# EAGLE design RS232 (EAGLE 4.15)
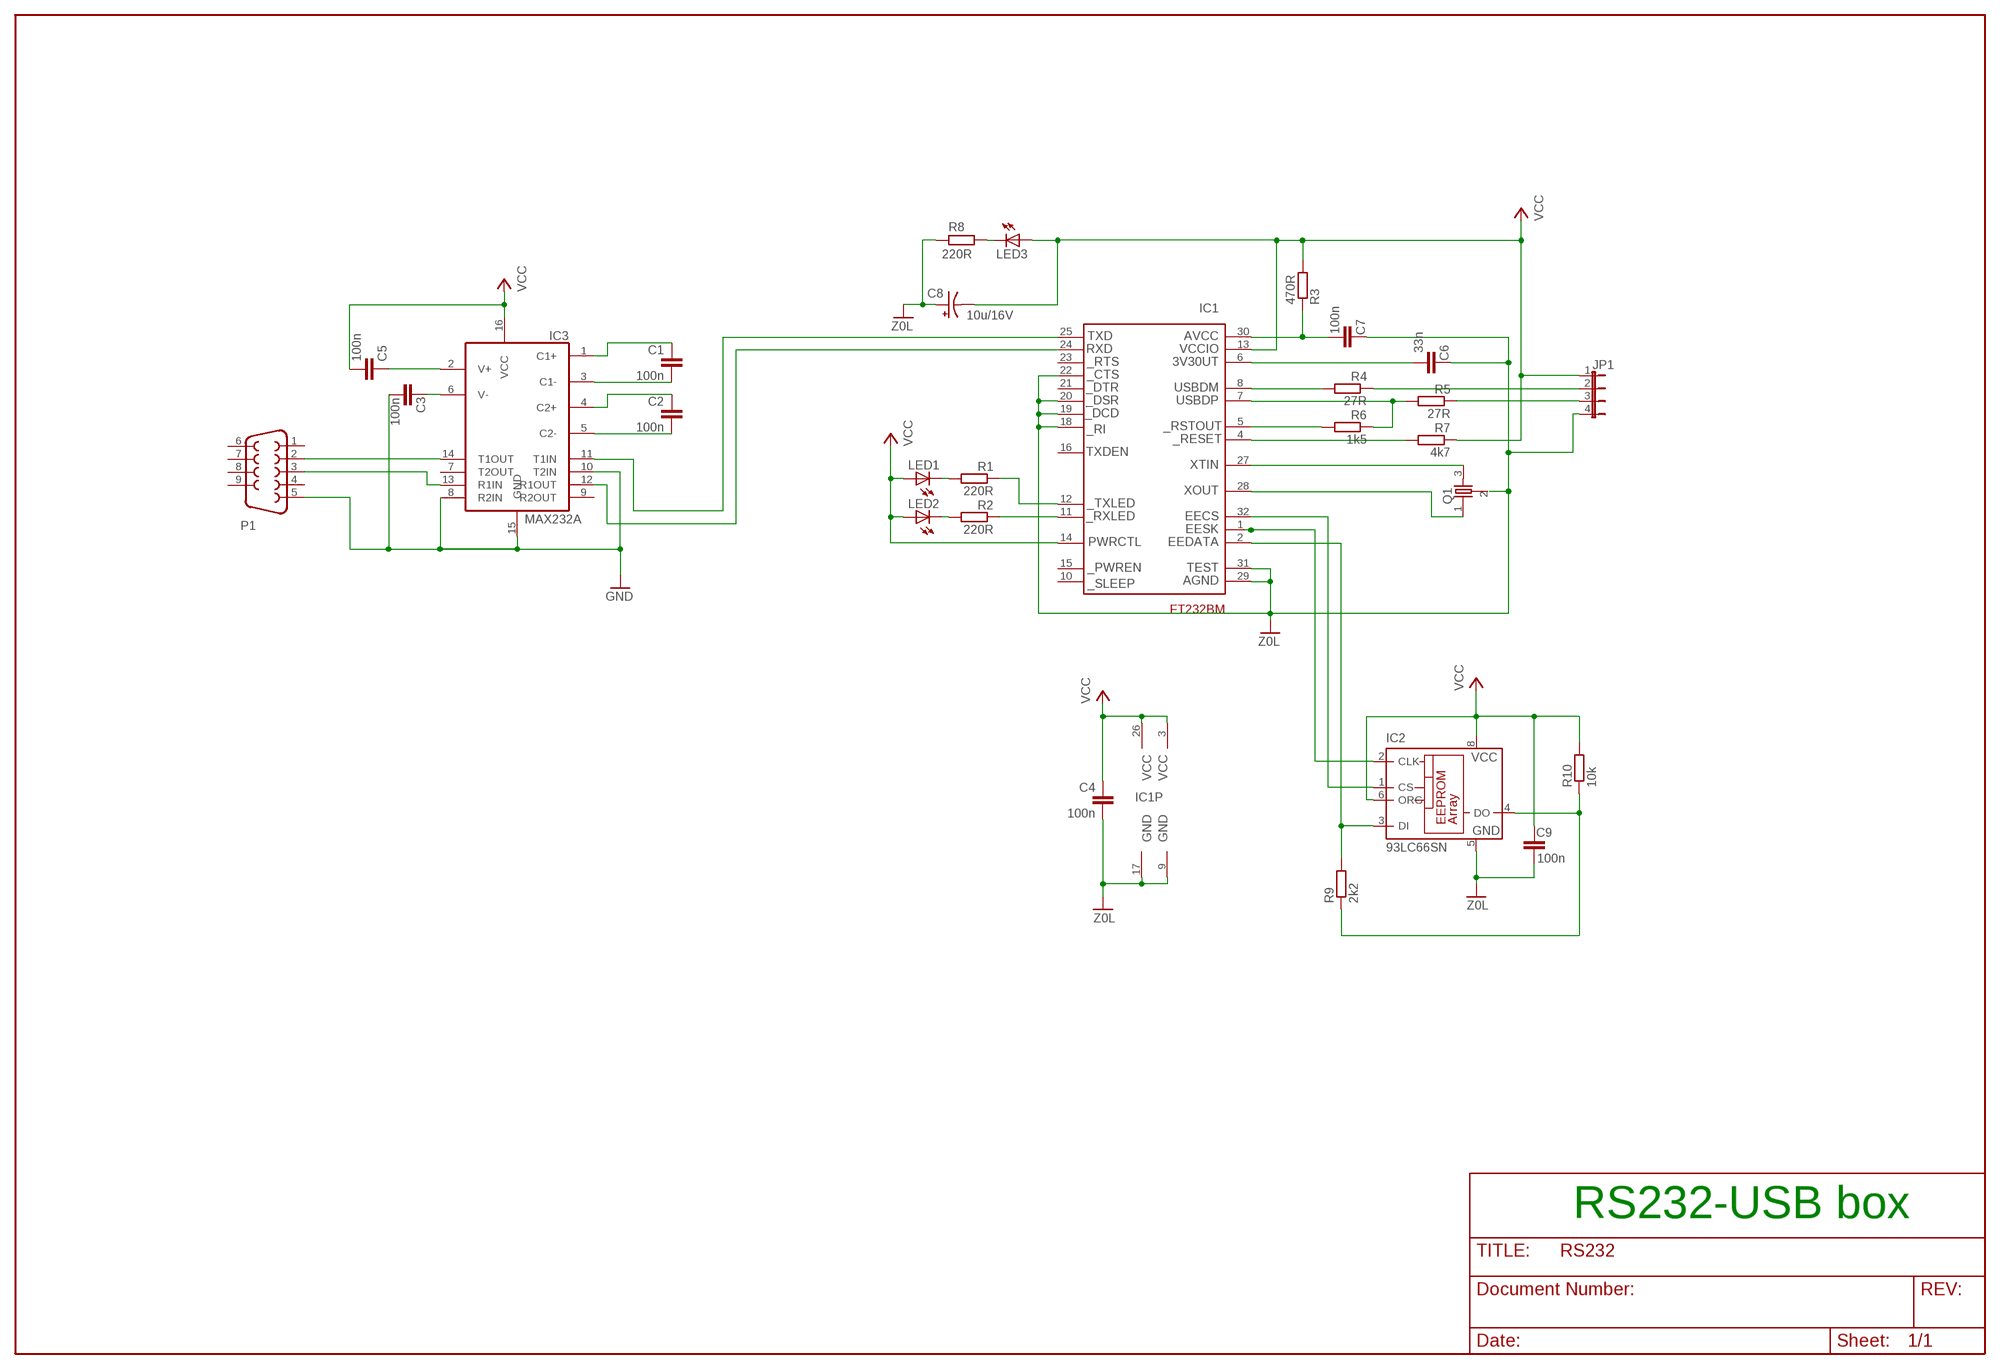
[diagram p0: schematic, sheet 1]

## Parts
C1  100n  C-EUC0805K  [C0805K]
C2  100n  C-EUC0805K  [C0805K]
C3  100n  C-EUC0805K  [C0805K]
C4  100n  C-EUC0805K  [C0805K]
C5  100n  C-EUC0805K  [C0805K]
C6  33n  C-EUC0805K  [C0805K]
C7  100n  C-EUC0805K  [C0805K]
C8  10u/16V  CPOL-USB  [PANASONIC_B]
C9  100n  C-EUC0805K  [C0805K]
IC1  FT232BM  [TQFP32-08]
IC2  93LC66SN  [SO-08]
IC3  MAX232A  [SO16]
JP1  JP4E  [JP4]
LED1  LED3MM  [LED3MM]
LED2  LED3MM  [LED3MM]
LED3  LED3MM  [LED3MM]
P1  D_SUB_CONNECTOR_SMD  [D_SUB_DON_SMD]
Q1  MURATA_RESONATOR  [MURATA_RESONATOR]
R1  220R  R-EU_M0805  [M0805]
R2  220R  R-EU_M0805  [M0805]
R3  470R  R-EU_M0805  [M0805]
R4  27R  R-EU_M0805  [M0805]
R5  27R  R-EU_M0805  [M0805]
R6  1k5  R-EU_M0805  [M0805]
R7  4k7  R-EU_M0805  [M0805]
R8  220R  R-EU_M0805  [M0805]
R9  2k2  R-EU_M0805  [M0805]
R10  10k  R-EU_M0805  [M0805]

## Nets
0V: C4.2 C6.1 C7.1 C8.+ C9.2 IC1.9 IC1.17 IC1.18 IC1.19 IC1.20 IC1.22 IC1.29 IC1.31 IC2.5(GND) JP1.4 Q1.2 R8.1 ; supply symbol labelled Z0L
GND: C3.2 IC3.8(R2IN) IC3.10(T2IN) IC3.15(GND) P1.5
N$1: IC1.12 R1.1
N$2: IC3.13(R1IN) P1.3
N$3: IC1.11 R2.1
N$4: IC1.1 IC2.2(CLK)
N$5: LED1.K(C) R1.2
N$6: LED2.K(C) R2.2
N$7: C6.2 IC1.6
N$8: C7.2 IC1.30 R3.1
N$9: IC1.8 R4.2
N$10: JP1.2 R4.1
N$11: IC1.7 R5.2 R6.1
N$12: JP1.3 R5.1
N$13: IC1.5 R6.2
N$14: IC1.4 R7.2
N$15: LED3.K(C) R8.2
N$16: IC1.32 IC2.1(CS)
N$17: C8.- LED3.A
N$18: IC1.27 Q1.3
N$19: IC1.28 Q1.1
N$21: IC1.2 IC2.3(DI) R9.2
N$22: IC1.24 IC3.12(R1OUT)
N$23: IC1.25 IC3.11(T1IN)
N$24: IC3.14(T1OUT) P1.2
N$25: IC2.4(DO) R9.1 R10.1
N$36: C2.2 IC3.5(C2-)
N$37: C2.1 IC3.4(C2+)
N$38: C1.2 IC3.3(C1-)
N$39: C1.1 IC3.1(C1+)
N$40: C5.1 IC3.2(V+)
N$41: C3.1 IC3.6(V-)
VCC: C4.1 C5.2 C9.1 IC1.3 IC1.13 IC1.14 IC1.26 IC2.6(ORG) IC2.8(VCC) IC3.16(VCC) JP1.1 LED1.A LED2.A R3.2 R7.1 R10.2
Unconnected: IC1.10 IC1.15 IC1.16 IC1.21 IC1.23 IC2.7(NU) IC3.7(T2OUT) IC3.9(R2OUT) P1.1 P1.4 P1.6 P1.7 P1.8 P1.9

## Notes on the sheet
- RS232-USB box

## Library data of the parts
C1-C7 C9 = rcl:C-EU: CAPACITOR, European symbol
C8 = rcl:CPOL-US: POLARIZED CAPACITOR, American symbol
IC1 = lbm:FT232BM: MICROCONTROLLER 2 Kbytes FLASH 128 bytes SRAM 128 bytes EEPROM UART 6-channel 10-bit ADC
IC2 = microchip:93*: Serial EPROM 1 K/2 K/4 K, low voltage, Microwire
IC3 = lbm:MAX232A
JP1 = jumper:JP4E: JUMPER
LED1-LED3 = led:LED: LED OSRAM: - CHIPLED LG R971, LG N971, LY N971, LG Q971, LY Q971, LO R971, LY R971 LH N974, LH R974 LS Q976, LO Q976, LY Q976 LO Q996 - Hyper CHIPLED LW Q18S LB Q993, LB Q99A, LB R99A - SideLED LS A670, LO A670, LY A670, LG A670, LP A670 LB A673, LV A673, LT A673, LW A673 LH A674 LY A675 LS A676, LA A676, LO A676, LY A676, LW A676 LS A679, LY A679, LG A679 - Hyper Micro SIDELED® LS Y876, LA Y876, LO Y876, LY Y876 LT Y87S - SmartLED LW L88C, LW L88S LB L89C, LB L89S, LG L890 LS L89K, LO L89K, LY L89K LS L896, LA L896, LO L896, LY L896 - TOPLED LS T670, LO T670, LY T670, LG T670, LP T670 LSG T670, LSP T670, LSY T670, LOP T670, LYG T670 LG T671, LOG T671, LSG T671 LB T673, LV T673, LT T673, LW T673 LH T674 LS T676, LA T676, LO T676, LY T676, LB T676, LH T676, LSB T676, LW T676 LB T67C, LV T67C, LT T67C, LS T67K, LO T67K, LY T67K, LW E67C LS E67B, LA E67B, LO E67B, LY E67B, LB E67C, LV E67C, LT E67C LW T67C LS T679, LY T679, LG T679 LS T770, LO T770, LY T770, LG T770, LP T770 LB T773, LV T773, LT T773, LW T773 LH T774 LS E675, LA E675, LY E675, LS T675 LS T776, LA T776, LO T776, LY T776, LB T776 LHGB T686 LT T68C, LB T68C - Hyper Mini TOPLED® LB M676 - Mini TOPLED Santana® LG M470 LS M47K, LO M47K, LY M47K Source: http://www.osram.convergy.de/
P1 = lbm:D_SUB_CONNECTOR_SMD
Q1 = lbm:MURATA_RESONATOR
R1-R10 = rcl:R-EU_: RESISTOR, European symbol

## Board
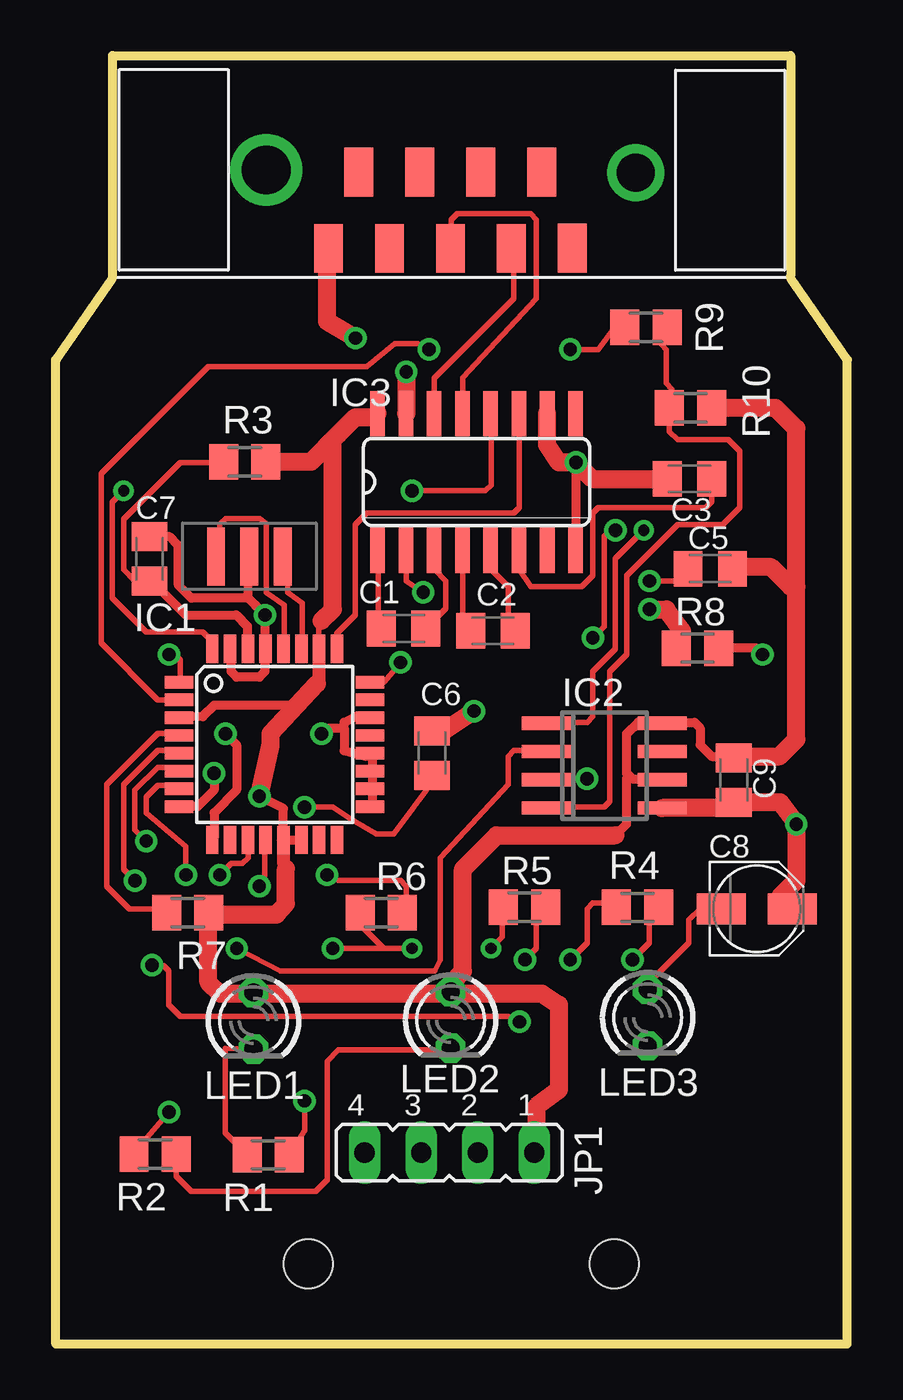
[diagram p1: board, top side]
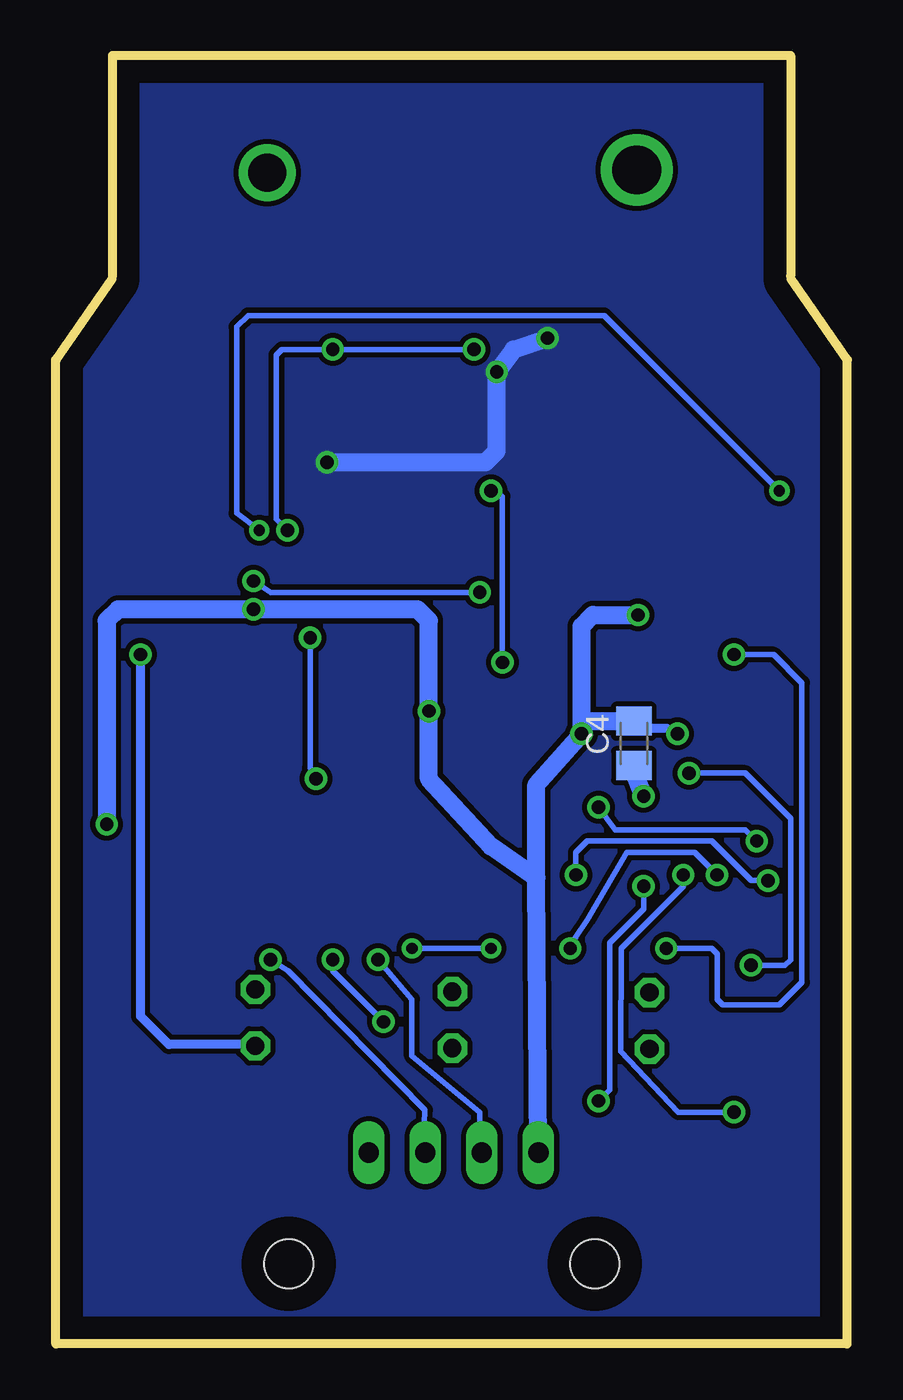
[diagram p2: board, bottom side, seen from below]

Size 35.58 x 57.91 mm. Coordinates in mm from the lower left corner, seen from the top.
Outline: 35.57,44.2 35.57,0 0.01,0 0.01,44.2
Outline: 2.54,47.88 0,44.22
Outline: 33.03,48.01 33.03,57.91 2.55,57.91 2.55,48.01
Outline: 33.04,47.88 35.58,44.22
Copper layers (1*16): Top 0.035mm / dielectric 1.5mm / Bottom 0.035mm
Design rules "default": minimum track width 8mil, minimum drill 20mil, track to track 9mil, track to pad 8mil, pad to pad 7mil, via to via 8mil, smd to smd 8mil, copper to edge 40mil, drill to drill 8mil, minimum pad ring 10mil, minimum via ring 8mil, stop-mask expansion 4mil, vias tented up to drill 0mil, thermal gap 10mil
Holes 2.2 mm at 11.36,3.6 25.1,3.6

### Footprints (pad centres in the part's own frame; a part is rotated, then mirrored left to right if it is on the bottom)
C0805K = smd 1.3 x 1.6: 1 -1,0; 2 1,0
PANASONIC_B = smd 2.2 x 1.4: + 1.6,0; - -1.6,0
TQFP32-08 = smd 1.27 x 0.559: 1 -4.293,2.8; 2 -4.293,2; 3 -4.293,1.2; 4 -4.293,0.4; 5 -4.293,-0.4; 6 -4.293,-1.2; 7 -4.293,-2; 8 -4.293,-2.8; 17 4.293,-2.8; 18 4.293,-2; 19 4.293,-1.2; 20 4.293,-0.4; 21 4.293,0.4; 22 4.293,1.2; 23 4.293,2; 24 4.293,2.8 | smd 0.559 x 1.27: 9 -2.8,-4.293; 10 -2,-4.293; 11 -1.2,-4.293; 12 -0.4,-4.293; 13 0.4,-4.293; 14 1.2,-4.293; 15 2,-4.293; 16 2.8,-4.293; 25 2.8,4.293; 26 2,4.293; 27 1.2,4.293; 28 0.4,4.293; 29 -0.4,4.293; 30 -1.2,4.293; 31 -2,4.293; 32 -2.8,4.293
SO-08 = smd 0.6 x 2.2: 1 -1.905,-2.6; 2 -0.635,-2.6; 3 0.635,-2.6; 4 1.905,-2.6; 5 1.905,2.6; 6 0.635,2.6; 7 -0.635,2.6; 8 -1.905,2.6
SO16 = smd 0.66 x 2.032: 1 -4.445,-3.073; 2 -3.175,-3.073; 3 -1.905,-3.073; 4 -0.635,-3.073; 5 0.635,-3.073; 6 1.905,-3.073; 7 3.175,-3.073; 8 4.445,-3.073; 9 4.445,3.073; 10 3.175,3.073; 11 1.905,3.073; 12 0.635,3.073; 13 -0.635,3.073; 14 -1.905,3.073; 15 -3.175,3.073; 16 -4.445,3.073
JP4 = drill 0.914 long: 1 -3.81,0; 2 -1.27,0; 3 1.27,0; 4 3.81,0
LED3MM = drill 0.813 octagon: A -1.27,0; K 1.27,0
D_SUB_DON_SMD = smd 1.3 x 2.2: 1 10.26,-2.308; 2 7.52,-2.318; 3 4.78,-2.318; 4 2.04,-2.318; 5 -0.7,-2.318; 6 8.88,1.102; 7 6.14,1.102; 8 3.4,1.102; 9 0.66,1.102 | drill 2.2 round: P$1 -3.5,1.21 | drill 1.7 round: P$2 13.11,1.09
MURATA_RESONATOR = smd 0.8 x 2.6: 1 -1.5,0; 2 0,0; 3 1.5,0
M0805 = smd 1.3 x 1.6: 1 -0.95,0; 2 0.95,0

### Placement (x,y rotation side)
C1  15.64,32.16 0 top
C2  19.65,32.06 0 top
C3  28.49,38.89 180 top
C4  9.59,26.99 90 bottom
C5  29.42,34.85 0 top
C6  16.92,26.56 270 top
C7  4.21,35.29 270 top
C8  31.51,19.56 0 top
C9  30.47,25.35 270 top
IC1  9.84,26.95 0 top
IC2  24.66,25.99 270 top
IC3  18.91,38.75 0 top
JP1  17.7,8.59 180 top
LED1  8.89,14.53 270 top
LED2  17.75,14.57 270 top
LED3  26.61,14.67 270 top
P1  12.96,51.56 0 top
Q1  8.71,35.4 0 top
R1  9.55,8.5 180 top
R2  4.47,8.53 0 top
R3  8.5,39.65 0 top
R4  26.15,19.62 180 top
R5  21.07,19.64 180 top
R6  14.63,19.38 0 top
R7  5.94,19.38 180 top
R8  28.84,31.28 0 top
R9  26.53,45.7 180 top
R10  28.53,42.07 0 top

### Tracks (layer width: path | path; a pad name or v marks a point on that pad's centre or on a via)
0V  (via drill 0.6)
  Top 0.406: 14.09,28.19 IC1.22 13.92,28.19 13.47,28.19 12.96,27.94 12.96,27.69 | IC1.17 14.23,24.25 14.23,24.89 | 14.23,26.42 14.23,24.89 | 14.23,26.42 14.23,26.45 IC1.20 14.11,26.55 13.98,26.42 12.96,26.67 12.96,27.69 | IC1.19 14.23,25.85 14.23,26.42 | 14.23,24.89 14.19,24.89 IC1.18 | IC1.17 14.11,24.13 14.23,24.13 14.23,26.42 | 7.88,31.29 IC1.31 7.88,31.24 7.88,30.23 8.14,29.97 9.15,29.97 9.41,30.23 9.41,31.24 | 9.41,31.24 9.41,31.27 IC1.29 9.41,31.24 | IC1.9 7.12,22.74 7.12,23.88 8.14,24.89 8.14,26.92 v7.63,27.43 | IC1.17 14.21,24.15 | 9.41,31.24 v9.41,32.77 8.98,33.22 8.65,33.53 | Q1.2 8.71,35.37 8.65,35.31 8.65,33.53 | C7.1 5.12,36.29 5.52,35.89 5.52,34.11 6.11,33.53 8.65,33.53 | v11.95,27.43 12.2,27.69 12.96,27.69
  Top 0.813: v18.81,28.45 17.28,27.45 17.27,27.43 17.03,27.43 17.03,27.45 C6.1 | IC2.5 30.19,24.09 30.45,24.35 C9.2 32.56,24.35 v33.28,23.37 33.28,20.83 32.52,20.07 32.52,19.81 32.78,19.56 C8.+ | R8.1 28.15,32.06 27.44,33.02 v26.68,33.02
  Bottom 0.406: v7.63,27.43 8.14,27.69 10.05,27.69 C4.2
  Bottom 0.813: JP1.4 13.98,20.95 | 13.73,8.38 13.89,8.54 JP1.4 | 13.98,8.64 13.94,8.59 JP1.4 | v33.28,23.37 33.28,32.51 32.78,33.02 v26.68,33.02 19.31,33.02 18.81,32.51 v18.81,28.45 18.81,25.4 16.01,22.35 13.98,20.95 | 11.95,27.94 v11.95,27.43 13.98,25.15 13.98,20.95 | 11.95,27.94 11.95,32.26 11.44,32.77 v9.41,32.77 | C4.2 11.9,27.99 11.95,27.94
GND  (via drill 0.6)
  Top 0.406: IC3.8 23.36,35.8 23.38,35.81 v23.38,39.62
  Top 0.813: v13.47,45.21 12.26,45.91 12.2,45.97 12.2,48.51 | IC3.15 15.76,41.84 v15.76,43.69 | IC3.10 22.09,40.41 22.62,39.62 v23.38,39.62 24.12,38.89 27.67,38.89 27.49,38.82 C3.2 | 12.2,48.51 12.2,49.18 | P1.5 12.2,49.24 12.2,48.51
  Bottom 0.813: v13.47,45.21 15,44.7 v15.76,43.69 15.76,40.13 16.27,39.62 v23.38,39.62
  pour Bottom: 3.06,57.4 32.52,57.4 32.52,47.5 35.06,43.94 35.06,0.51 0.52,0.51 0.52,44.2 3.06,47.75 3.06,57.15
N$1  (via drill 0.6)
  Top 0.254: R1.1 11.19,9.6 v11.19,10.92 | IC1.12 9.41,22.62 9.41,21.08 v9.15,20.57
  Bottom 0.254: v11.19,10.92 10.68,11.43 10.68,18.03 9.15,19.56 v9.15,20.57
N$2
  Top 0.254: 17.76,49.24 P1.3 17.79,49.02 17.79,50.55 18.04,50.8 21.35,50.8 21.6,50.55 21.6,46.99 18.3,43.43 IC3.13
N$3  (via drill 0.6)
  Top 0.254: R2.1 3.57,8.57 3.57,8.64 v5.09,10.41 | IC1.11 8.64,22.61 8.65,22.61 8.65,21.84 8.39,21.59 7.88,21.59 v7.38,21.08
  Bottom 0.254: v5.09,10.41 7.6,10.41 10.18,13.15 10.17,17.78 7.38,20.57 v7.38,21.08
N$4  (via drill 0.6)
  Top 0.254: IC1.1 5.6,29.72 5.6,30.73 5.34,30.99 v5.09,30.99 | v8.14,17.78 10.09,16.76 17.03,16.76 17.28,17.27 17.28,21.84 20.33,25.15 20.33,26.42 20.58,26.67 22.11,26.67 IC2.2
  Bottom 0.254: 4.84,31.24 v5.09,30.99 3.31,30.99 2.04,29.72 2.04,16.26 3.06,15.24 5.6,15.24 5.85,15.49 5.85,17.53 6.11,17.78 v8.14,17.78
N$5
  Top 0.254: LED1.K 7.63,13.29 7.63,9.48 R1.2
N$6
  Top 0.254: 17.79,13.21 17.79,13.29 LED2.K | R2.2 5.42,7.54 6.11,6.86 11.69,6.86 12.2,7.37 12.2,12.7 12.71,13.21 17.79,13.21 | 17.79,13.21 17.78,13.22
N$7  (via drill 0.6)
  Top 0.254: 5.45,25.91 IC1.6 5.55,25.7 | v4.07,22.61 3.57,23.11 3.57,24.89 4.58,25.91 5.34,25.91 5.55,25.7 | v11.19,24.13 12.46,24.13 13.22,23.62 14.42,22.92 15.18,22.93 17.03,25.4 17.03,25.45 C6.2 | 5.55,25.7 5.6,25.65
  Bottom 0.254: v4.07,22.61 4.58,23.11 10.42,23.11 v11.19,24.13
N$8
  Top 0.254: IC1.30 | 4.33,34.29 3.57,34.29 3.06,34.8 3.06,37.08 5.6,39.62 7.38,39.62 7.4,39.65 R3.1
  Top 0.406: C7.2 4.33,34.29 5.85,32.77 8.11,32.77 8.62,32.26 8.62,31.24 IC1.30
N$9  (via drill 0.6)
  Top 0.254: 6.13,24.15 IC1.8 | v23.12,17.27 23.89,18.03 23.89,19.56 24.14,19.81 25.16,19.81 25.2,19.77 R4.2 | v4.33,17.02 4.84,17.02 5.09,16.76 5.09,15.24 5.6,14.73 20.33,14.73 v20.84,14.48
  Top 0.406: 6.13,24.15 6.38,24.15 7.12,24.89 v7.12,25.65
  Bottom 0.254: v4.33,17.02 2.8,17.02 2.55,17.27 2.55,23.62 4.58,25.65 v7.12,25.65 | v20.84,14.48 23.12,16.76 v23.12,17.27
N$10  (via drill 0.6)
  Top 0.254: R4.1 27.03,19.56 26.68,19.3 26.68,18.03 v25.92,17.27
  Bottom 0.254: JP1.2 19.02,8.59 19.06,8.64 18.99,10.52 25.13,16.76 v25.92,17.27
N$11  (via drill 0.51, 0.6)
  Top 0.203: R5.2 19.57,19.3 | 13.47,19.05 R6.1
  Top 0.254: 5.6,24.89 IC1.7 5.6,25 5.6,25.09 4.58,25.09 4.07,24.59 4.07,23.88 5.85,22.35 v5.85,21.08 | v19.57,17.78 20.08,18.29 20.08,19.81 R5.2 | v12.46,17.78 14.74,17.78 | 14.74,17.78 v16.01,17.78 | R6.1 13.68,19.26 13.47,19.05 14.74,17.78
  Bottom 0.254: v5.85,21.08 6.87,22.1 9.92,22.1 11.69,19.05 12.2,18.29 v12.46,17.78 | v16.01,17.78 v19.57,17.78
N$12  (via drill 0.6)
  Top 0.254: v21.09,17.27 21.6,17.78 21.6,19.05 22.11,19.56 R5.1
  Bottom 0.254: JP1.3 16.43,8.47 16.52,8.38 16.52,10.41 19.57,12.95 19.57,15.49 v21.09,17.27 21.09,17.02
N$13  (via drill 0.6)
  Top 0.254: v12.2,21.08 12.71,20.83 15.5,20.83 15.76,20.57 15.76,19.56 R6.2 | 5.09,26.67 5.14,26.62 arc45 5.31,26.55 IC1.5 5.46,26.55 5.34,26.67 4.58,26.67 3.06,25.15 3.06,21.34 v3.57,20.83
  Bottom 0.254: v3.57,20.83 4.33,20.83 6.11,22.61 11.69,22.61 12.2,22.1 v12.2,21.08
N$14
  Top 0.254: 5.37,27.43 IC1.4 5.55,27.38 5.6,27.43 4.58,27.43 2.3,25.15 2.3,20.57 3.31,19.56 4.84,19.56 4.99,19.4 R7.2
N$15  (via drill 0.6)
  Top 0.406: R8.2 31.51,31.28 31.51,31.24 v31.76,30.99
  Bottom 0.406: v31.76,30.99 31.76,14.73 30.49,13.46 26.68,13.46 LED3.K
N$16  (via drill 0.51)
  Top 0.203: 6.87,31.75 IC1.32 | 22.36,27.94 IC2.1
  Top 0.254: 22.36,27.94 23.89,27.94 24.14,28.19 24.14,30.23 25.16,31.24 25.16,35.31 v26.43,36.58 | 6.87,31.75 6.61,32 4.07,32 2.55,33.53 2.55,37.85 v3.06,38.35
  Bottom 0.254: v26.43,36.58 27.44,37.34 27.44,45.72 26.93,46.23 10.93,46.23 v3.06,38.35
N$17
  Top 0.254: C8.- 28.97,19.56 28.46,19.05 28.46,18.03 26.61,16.18 LED3.A
N$18
  Top 0.254: Q1.3 10.21,35.27 10.42,35.05 10.42,33.78 11.08,33.3 11.08,31.27 10.93,31.24 IC1.27
N$19
  Top 0.254: 7.12,35.31 7.38,35.05 | 7.12,35.31 Q1.1 | 7.12,35.31 7.12,36.07 7.35,36.22 7.38,36.85 7.65,37.11 9.18,37.11 9.46,36.88 9.46,33.78 10.26,33.2 10.26,31.36 10.22,31.32 10.24,31.3 IC1.28
N$21  (via drill 0.6)
  Top 0.254: IC2.3 22.1,25.4 v23.89,25.4 | 25.16,45.47 25.92,45.21 | 25.16,45.47 25.16,45.62 R9.2 25.58,45.89 | v24.14,31.75 24.65,32.26 24.65,36.32 24.9,36.58 v25.16,36.58 | v23.12,44.7 24.39,44.7 25.16,45.72 25.16,45.47 | 25.58,45.89 25.66,45.97 | 25.16,45.47 25.58,45.89 | IC1.2 4.59,28.95 2.04,31.5 2.04,39.12 6.87,43.94 13.98,43.94 15.25,44.96 16.27,44.96 v16.77,44.7
  Bottom 0.254: v23.89,25.4 24.14,25.91 v24.14,31.75 | v25.16,36.58 25.66,37.08 25.66,44.45 25.41,44.7 v23.12,44.7 v16.77,44.7
N$22  (via drill 0.6)
  Top 0.254: IC1.24 14.77,29.75 v15.5,30.63 | v16.01,38.35 19.31,38.35 19.57,38.61 19.57,41.91 19.55,41.89 IC3.12
  Bottom 0.254: v15.5,30.63 15.5,38.1 15.76,38.35 v16.01,38.35
N$23
  Top 0.254: IC1.25 12.64,31.93 13.47,32.77 13.47,36.83 13.98,37.34 20.58,37.34 20.84,37.59 20.84,41.66 20.82,41.67 IC3.11
N$24
  Top 0.254: IC3.14 17.01,43.41 20.58,46.99 20.58,49.02 20.48,49.12 P1.2
N$25
  Top 0.203: R10.1 27.7,42.67
  Top 0.254: R9.1 27.23,44.92 27.44,44.7 27.44,43.18 27.7,42.93 27.7,42.67 27.7,42.16 27.67,42.16 | R10.1 27.58,41.01 27.95,40.64 30.24,40.64 30.74,40.13 30.74,37.59 29.98,36.83 27.95,36.83 25.66,34.54 25.66,30.99 24.9,30.23 24.9,24.38 24.65,24.13 22.11,24.13 IC2.4
  Top 0.406: R10.1 27.7,42.07 27.7,42.16
N$36
  Top 0.254: C2.2 20.33,32.38 20.33,34.04 19.57,34.8 19.57,35.65 IC3.5
N$37
  Top 0.254: IC3.4 18.3,35.65 18.3,32.41 C2.1
N$38
  Top 0.254: C1.2 17.54,33.06 17.54,34.29 17.03,34.8 17.03,35.65 IC3.3
N$39
  Top 0.254: C1.1 14.48,32.26 14.49,32.26 14.49,35.65 IC3.1
N$40  (via drill 0.6)
  Top 0.254: C5.1 28.2,34.64 28.2,34.29 v26.68,34.29 | IC3.2 15.76,35.65 15.76,34.29 v16.52,33.78
  Bottom 0.254: v26.68,34.29 25.92,33.78 v16.52,33.78
N$41
  Top 0.254: C3.1 29.49,37.86 29.22,37.59 24.39,37.59 24.14,37.34 24.14,34.54 23.63,34.04 21.35,34.04 20.84,34.8 20.84,35.56 IC3.6
VCC  (via drill 0.6)
  Top 0.254: 17.79,15.75 18.04,15.75 | 11.82,31.32 11.82,32.38 11.95,32.51
  Top 0.406: 10.17,23.11 10.22,22.66 IC1.13 | IC1.14 10.98,22.66 10.93,22.61 10.88,22.66 IC1.13 | IC1.13 10.24,24.06 v9.15,24.61 | IC2.6 27.21,25.4 25.92,25.4 25.79,25.53 | 25.79,25.53 25.66,25.65 25.66,27.43 26.17,27.94 27.21,27.94 IC2.8 27.3,27.94 28.71,27.94 28.97,27.69 28.97,26.92 29.47,26.42 30.24,26.42 C9.1 | 25.79,25.53 25.66,25.4 25.66,23.37 25.16,22.86 | IC1.3 6.61,28.19 7.12,28.7 10.68,28.7 9.92,27.94 9.66,26.92 | LED2.A 17.78,15.99 17.79,15.75
  Top 0.508: 11.84,31.3 11.82,31.32 | 11.84,31.3 IC1.26 | 11.85,31.29 11.84,31.3 | 10.35,21.36 10.42,21.39 | 10.27,22.66 IC1.13
  Top 0.584: 11.74,29.67 11.85,29.87 11.85,31.29 | 10.42,21.39 10.42,21.44 10.25,21.61 10.25,22.63 10.24,22.64 IC1.13
  Top 0.813: 17.79,15.75 17.78,16.01 | 8.39,15.75 8.89,15.74 LED1.A | 8.39,15.75 17.79,15.75 | 8.39,15.75 7.38,15.75 6.87,16.26 6.87,19.05 6.89,19.07 R7.1 | R7.1 7.14,19.33 | 10.35,21.36 10.35,19.79 9.92,19.3 7.12,19.3 R7.1 | C5.2 30.61,34.91 32.15,34.91 33.03,34.04 33.28,34.04 | v9.15,24.61 9.66,26.92 9.66,27.43 11.74,29.67 | JP1.1 21.6,8.69 21.6,10.67 22.62,11.43 22.62,15.24 21.85,15.75 18.04,15.75 17.95,16 | 17.79,15.75 17.7,16.09 18.3,16.76 18.3,21.34 19.82,22.86 25.16,22.86 | 11.95,32.51 12.46,33.02 12.46,40.64 12.71,40.89 | IC3.16 14.31,41.66 13.47,41.66 12.71,40.89 | R3.2 11.47,39.65 12.71,40.89 | R10.2 32.36,42.07 33.28,41.15 33.28,34.04 | 33.28,34.04 33.28,27.18 32.52,26.42 30.74,26.42 30.49,26.16 30.47,26.18 C9.1
  Bottom 0.813: C4.1 9.66,25.91 v9.15,24.61